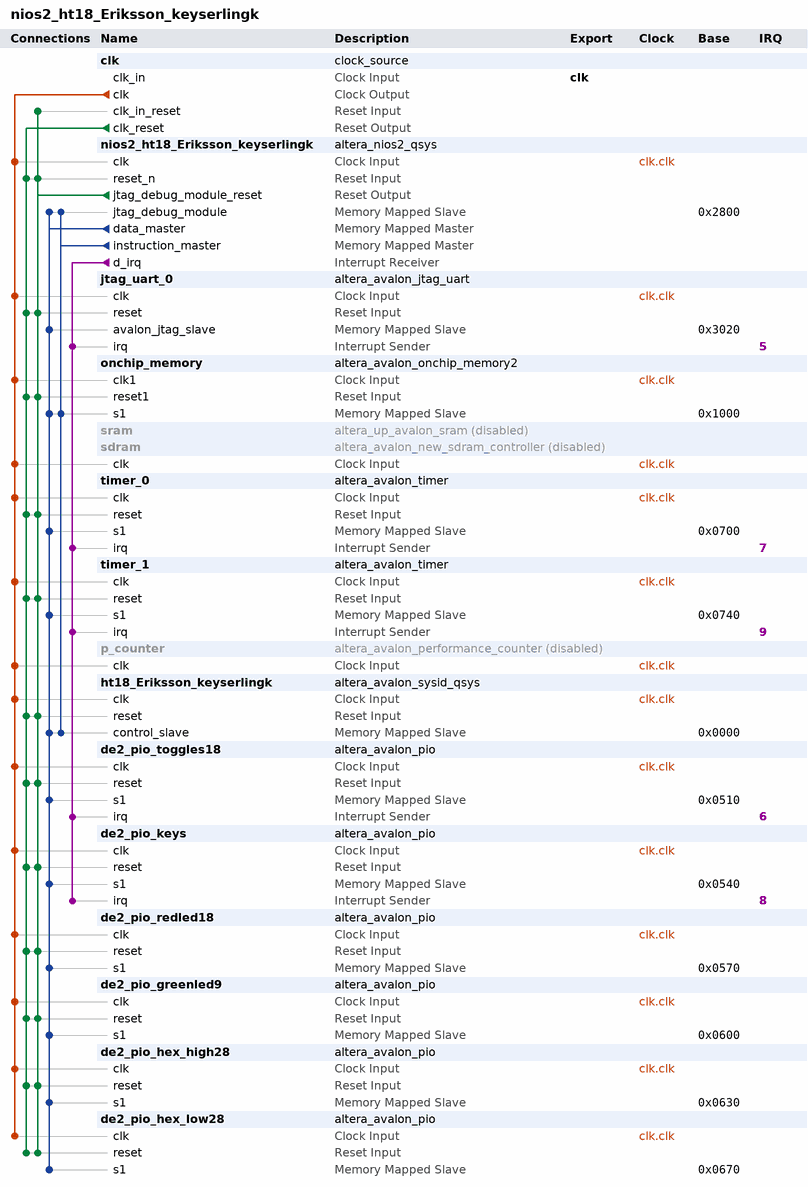
[diagram p0: system contents]
# Platform Designer (Qsys) system nios2_ht18_Eriksson_keyserlingk, Cyclone II EP2C35F672C6
# Parameters at their usual value, and those the tool derives, are not listed.
package require -exact qsys 13.0.1.99.2
create_system nios2_ht18_Eriksson_keyserlingk
set_project_property DEVICE_FAMILY {Cyclone II}
set_project_property DEVICE EP2C35F672C6

add_instance clk clock_source 13.0
set_instance_parameter_value clk clockFrequency 50000000

add_instance nios2_ht18_Eriksson_keyserlingk altera_nios2_qsys 13.0
set_instance_parameter_value nios2_ht18_Eriksson_keyserlingk resetSlave onchip_memory.s1
set_instance_parameter_value nios2_ht18_Eriksson_keyserlingk mmu_TLBMissExcSlave None
set_instance_parameter_value nios2_ht18_Eriksson_keyserlingk exceptionSlave onchip_memory.s1
set_instance_parameter_value nios2_ht18_Eriksson_keyserlingk breakSlave nios2_ht18_Eriksson_keyserlingk.jtag_debug_module
set_instance_parameter_value nios2_ht18_Eriksson_keyserlingk impl Tiny
set_instance_parameter_value nios2_ht18_Eriksson_keyserlingk icache_size 4096

add_instance jtag_uart_0 altera_avalon_jtag_uart 13.0.1.99.2
set_instance_parameter_value jtag_uart_0 readIRQThreshold 5
set_instance_parameter_value jtag_uart_0 simInteractiveOptions NO_INTERACTIVE_WINDOWS
set_instance_parameter_value jtag_uart_0 writeIRQThreshold 5

add_instance onchip_memory altera_avalon_onchip_memory2 13.0.1.99.2
set_instance_parameter_value onchip_memory dataWidth 32
set_instance_parameter_value onchip_memory dualPort false
set_instance_parameter_value onchip_memory initMemContent true
set_instance_parameter_value onchip_memory initializationFileName onchip_mem.hex
set_instance_parameter_value onchip_memory memorySize 4096

add_instance sram altera_up_avalon_sram 13.0
set_instance_property sram ENABLED false
set_instance_parameter_value sram board DE2
set_instance_parameter_value sram pixel_buffer false

add_instance sdram altera_avalon_new_sdram_controller 13.0.1.99.2
set_instance_property sdram ENABLED false
set_instance_parameter_value sdram TAC 5.5
set_instance_parameter_value sdram TRCD 20.0
set_instance_parameter_value sdram TRP 20.0
set_instance_parameter_value sdram casLatency 3
set_instance_parameter_value sdram columnWidth 8
set_instance_parameter_value sdram dataWidth 32
set_instance_parameter_value sdram generateSimulationModel false
set_instance_parameter_value sdram model single_Micron_MT48LC4M32B2_7_chip
set_instance_parameter_value sdram numberOfBanks 4
set_instance_parameter_value sdram numberOfChipSelects 1
set_instance_parameter_value sdram powerUpDelay 100.0
set_instance_parameter_value sdram refreshPeriod 15.625
set_instance_parameter_value sdram rowWidth 12

add_instance timer_0 altera_avalon_timer 13.0.1.99.2
set_instance_parameter_value timer_0 period 1
set_instance_parameter_value timer_0 periodUnits MSEC

add_instance timer_1 altera_avalon_timer 13.0.1.99.2
set_instance_parameter_value timer_1 period 2
set_instance_parameter_value timer_1 periodUnits MSEC

add_instance p_counter altera_avalon_performance_counter 13.0.1.99.2
set_instance_property p_counter ENABLED false
set_instance_parameter_value p_counter numberOfSections 7

add_instance ht18_Eriksson_keyserlingk altera_avalon_sysid_qsys 13.0
set_instance_parameter_value ht18_Eriksson_keyserlingk id 0

add_instance de2_pio_toggles18 altera_avalon_pio 13.0.1.99.2
set_instance_parameter_value de2_pio_toggles18 direction Input
set_instance_parameter_value de2_pio_toggles18 generateIRQ true
set_instance_parameter_value de2_pio_toggles18 width 18

add_instance de2_pio_keys altera_avalon_pio 13.0.1.99.2
set_instance_parameter_value de2_pio_keys direction Input
set_instance_parameter_value de2_pio_keys generateIRQ true
set_instance_parameter_value de2_pio_keys width 4

add_instance de2_pio_redled18 altera_avalon_pio 13.0.1.99.2
set_instance_parameter_value de2_pio_redled18 direction Output
set_instance_parameter_value de2_pio_redled18 width 18

add_instance de2_pio_greenled9 altera_avalon_pio 13.0.1.99.2
set_instance_parameter_value de2_pio_greenled9 direction Output
set_instance_parameter_value de2_pio_greenled9 width 9

add_instance de2_pio_hex_high28 altera_avalon_pio 13.0.1.99.2
set_instance_parameter_value de2_pio_hex_high28 direction Output
set_instance_parameter_value de2_pio_hex_high28 width 28

add_instance de2_pio_hex_low28 altera_avalon_pio 13.0.1.99.2
set_instance_parameter_value de2_pio_hex_low28 direction Output
set_instance_parameter_value de2_pio_hex_low28 width 28

# connections
add_connection clk.clk de2_pio_greenled9.clk clock
add_connection clk.clk de2_pio_hex_high28.clk clock
add_connection clk.clk de2_pio_hex_low28.clk clock
add_connection clk.clk de2_pio_keys.clk clock
add_connection clk.clk de2_pio_redled18.clk clock
add_connection clk.clk de2_pio_toggles18.clk clock
add_connection clk.clk ht18_Eriksson_keyserlingk.clk clock
add_connection clk.clk jtag_uart_0.clk clock
add_connection clk.clk nios2_ht18_Eriksson_keyserlingk.clk clock
add_connection clk.clk onchip_memory.clk1 clock
add_connection clk.clk p_counter.clk clock
add_connection clk.clk sdram.clk clock
add_connection clk.clk timer_0.clk clock
add_connection clk.clk timer_1.clk clock
add_connection clk.clk_reset de2_pio_greenled9.reset reset
add_connection clk.clk_reset de2_pio_hex_high28.reset reset
add_connection clk.clk_reset de2_pio_hex_low28.reset reset
add_connection clk.clk_reset de2_pio_keys.reset reset
add_connection clk.clk_reset de2_pio_redled18.reset reset
add_connection clk.clk_reset de2_pio_toggles18.reset reset
add_connection clk.clk_reset ht18_Eriksson_keyserlingk.reset reset
add_connection clk.clk_reset jtag_uart_0.reset reset
add_connection clk.clk_reset nios2_ht18_Eriksson_keyserlingk.reset_n reset
add_connection clk.clk_reset onchip_memory.reset1 reset
add_connection clk.clk_reset timer_0.reset reset
add_connection clk.clk_reset timer_1.reset reset
add_connection nios2_ht18_Eriksson_keyserlingk.jtag_debug_module_reset clk.clk_in_reset reset
add_connection nios2_ht18_Eriksson_keyserlingk.jtag_debug_module_reset de2_pio_greenled9.reset reset
add_connection nios2_ht18_Eriksson_keyserlingk.jtag_debug_module_reset de2_pio_hex_high28.reset reset
add_connection nios2_ht18_Eriksson_keyserlingk.jtag_debug_module_reset de2_pio_hex_low28.reset reset
add_connection nios2_ht18_Eriksson_keyserlingk.jtag_debug_module_reset de2_pio_keys.reset reset
add_connection nios2_ht18_Eriksson_keyserlingk.jtag_debug_module_reset de2_pio_redled18.reset reset
add_connection nios2_ht18_Eriksson_keyserlingk.jtag_debug_module_reset de2_pio_toggles18.reset reset
add_connection nios2_ht18_Eriksson_keyserlingk.jtag_debug_module_reset ht18_Eriksson_keyserlingk.reset reset
add_connection nios2_ht18_Eriksson_keyserlingk.jtag_debug_module_reset jtag_uart_0.reset reset
add_connection nios2_ht18_Eriksson_keyserlingk.jtag_debug_module_reset nios2_ht18_Eriksson_keyserlingk.reset_n reset
add_connection nios2_ht18_Eriksson_keyserlingk.jtag_debug_module_reset onchip_memory.reset1 reset
add_connection nios2_ht18_Eriksson_keyserlingk.jtag_debug_module_reset timer_0.reset reset
add_connection nios2_ht18_Eriksson_keyserlingk.jtag_debug_module_reset timer_1.reset reset
add_connection nios2_ht18_Eriksson_keyserlingk.data_master de2_pio_greenled9.s1 avalon
set_connection_parameter_value nios2_ht18_Eriksson_keyserlingk.data_master/de2_pio_greenled9.s1 baseAddress 0x0600
add_connection nios2_ht18_Eriksson_keyserlingk.data_master de2_pio_hex_high28.s1 avalon
set_connection_parameter_value nios2_ht18_Eriksson_keyserlingk.data_master/de2_pio_hex_high28.s1 baseAddress 0x0630
add_connection nios2_ht18_Eriksson_keyserlingk.data_master de2_pio_hex_low28.s1 avalon
set_connection_parameter_value nios2_ht18_Eriksson_keyserlingk.data_master/de2_pio_hex_low28.s1 baseAddress 0x0670
add_connection nios2_ht18_Eriksson_keyserlingk.data_master de2_pio_keys.s1 avalon
set_connection_parameter_value nios2_ht18_Eriksson_keyserlingk.data_master/de2_pio_keys.s1 baseAddress 0x0540
add_connection nios2_ht18_Eriksson_keyserlingk.data_master de2_pio_redled18.s1 avalon
set_connection_parameter_value nios2_ht18_Eriksson_keyserlingk.data_master/de2_pio_redled18.s1 baseAddress 0x0570
add_connection nios2_ht18_Eriksson_keyserlingk.data_master de2_pio_toggles18.s1 avalon
set_connection_parameter_value nios2_ht18_Eriksson_keyserlingk.data_master/de2_pio_toggles18.s1 baseAddress 0x0510
add_connection nios2_ht18_Eriksson_keyserlingk.data_master ht18_Eriksson_keyserlingk.control_slave avalon
set_connection_parameter_value nios2_ht18_Eriksson_keyserlingk.data_master/ht18_Eriksson_keyserlingk.control_slave baseAddress 0x0000
add_connection nios2_ht18_Eriksson_keyserlingk.data_master jtag_uart_0.avalon_jtag_slave avalon
set_connection_parameter_value nios2_ht18_Eriksson_keyserlingk.data_master/jtag_uart_0.avalon_jtag_slave baseAddress 0x3020
add_connection nios2_ht18_Eriksson_keyserlingk.data_master nios2_ht18_Eriksson_keyserlingk.jtag_debug_module avalon
set_connection_parameter_value nios2_ht18_Eriksson_keyserlingk.data_master/nios2_ht18_Eriksson_keyserlingk.jtag_debug_module baseAddress 0x2800
add_connection nios2_ht18_Eriksson_keyserlingk.data_master onchip_memory.s1 avalon
set_connection_parameter_value nios2_ht18_Eriksson_keyserlingk.data_master/onchip_memory.s1 baseAddress 0x1000
add_connection nios2_ht18_Eriksson_keyserlingk.data_master timer_0.s1 avalon
set_connection_parameter_value nios2_ht18_Eriksson_keyserlingk.data_master/timer_0.s1 baseAddress 0x0700
add_connection nios2_ht18_Eriksson_keyserlingk.data_master timer_1.s1 avalon
set_connection_parameter_value nios2_ht18_Eriksson_keyserlingk.data_master/timer_1.s1 baseAddress 0x0740
add_connection nios2_ht18_Eriksson_keyserlingk.instruction_master ht18_Eriksson_keyserlingk.control_slave avalon
set_connection_parameter_value nios2_ht18_Eriksson_keyserlingk.instruction_master/ht18_Eriksson_keyserlingk.control_slave baseAddress 0x0000
add_connection nios2_ht18_Eriksson_keyserlingk.instruction_master nios2_ht18_Eriksson_keyserlingk.jtag_debug_module avalon
set_connection_parameter_value nios2_ht18_Eriksson_keyserlingk.instruction_master/nios2_ht18_Eriksson_keyserlingk.jtag_debug_module baseAddress 0x2800
add_connection nios2_ht18_Eriksson_keyserlingk.instruction_master onchip_memory.s1 avalon
set_connection_parameter_value nios2_ht18_Eriksson_keyserlingk.instruction_master/onchip_memory.s1 baseAddress 0x1000
add_connection nios2_ht18_Eriksson_keyserlingk.d_irq de2_pio_keys.irq interrupt
set_connection_parameter_value nios2_ht18_Eriksson_keyserlingk.d_irq/de2_pio_keys.irq irqNumber 8
add_connection nios2_ht18_Eriksson_keyserlingk.d_irq de2_pio_toggles18.irq interrupt
set_connection_parameter_value nios2_ht18_Eriksson_keyserlingk.d_irq/de2_pio_toggles18.irq irqNumber 6
add_connection nios2_ht18_Eriksson_keyserlingk.d_irq jtag_uart_0.irq interrupt
set_connection_parameter_value nios2_ht18_Eriksson_keyserlingk.d_irq/jtag_uart_0.irq irqNumber 5
add_connection nios2_ht18_Eriksson_keyserlingk.d_irq timer_0.irq interrupt
set_connection_parameter_value nios2_ht18_Eriksson_keyserlingk.d_irq/timer_0.irq irqNumber 7
add_connection nios2_ht18_Eriksson_keyserlingk.d_irq timer_1.irq interrupt
set_connection_parameter_value nios2_ht18_Eriksson_keyserlingk.d_irq/timer_1.irq irqNumber 9

# exported interfaces
add_interface clk clock sink
set_interface_property clk EXPORT_OF clk.clk_in

set_interconnect_requirement {$system} qsys_mm.clockCrossingAdapter HANDSHAKE
set_interconnect_requirement {$system} qsys_mm.maxAdditionalLatency 1

save_system nios2_ht18_Eriksson_keyserlingk.qsys
